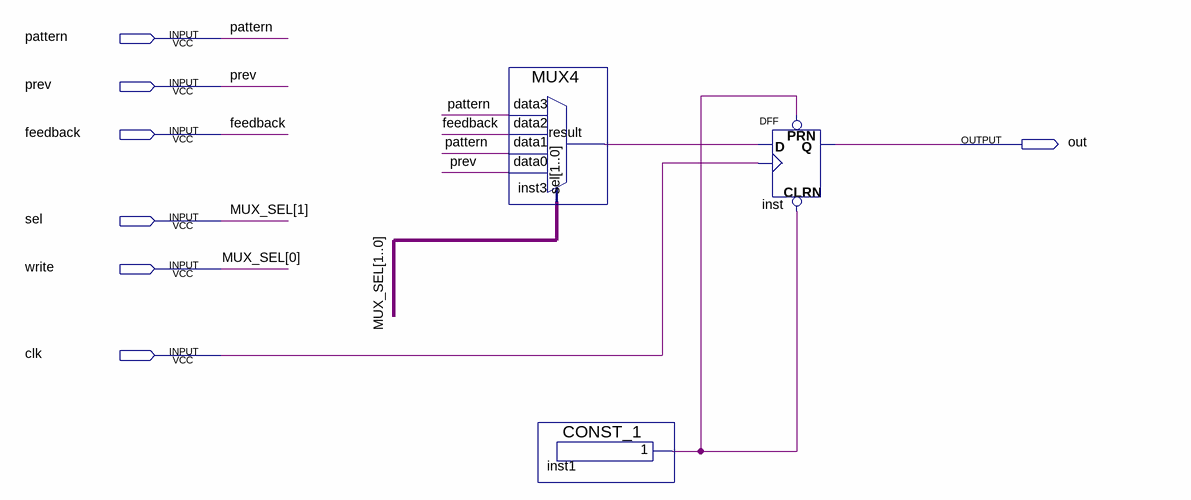
[diagram p0: schematic sheet]
// Quartus schematic SDFF.bdf as structural Verilog: 3 symbols, 7 pins
module SDFF (
  input  pattern,
  input  prev,
  input  feedback,
  input  sel,
  input  write,
  input  clk,
  output out
);

  wire inst1_result, inst3_result;

  MUX4 inst3 (
    .data3(pattern), .data2(feedback), .data1(pattern), .data0(prev), .sel({sel, write}),
    .result(inst3_result));
  CONST_1 inst1 (.result(inst1_result));
  DFF inst (.CLRN(inst1_result), .CLK(clk), .D(inst3_result), .PRN(inst1_result), .Q(out));

  // Other names for the same wires on the sheet: MUX_SEL[1:0] = {sel, write}
endmodule
